# EAGLE board ElectroLab (EAGLE 9.5.1)
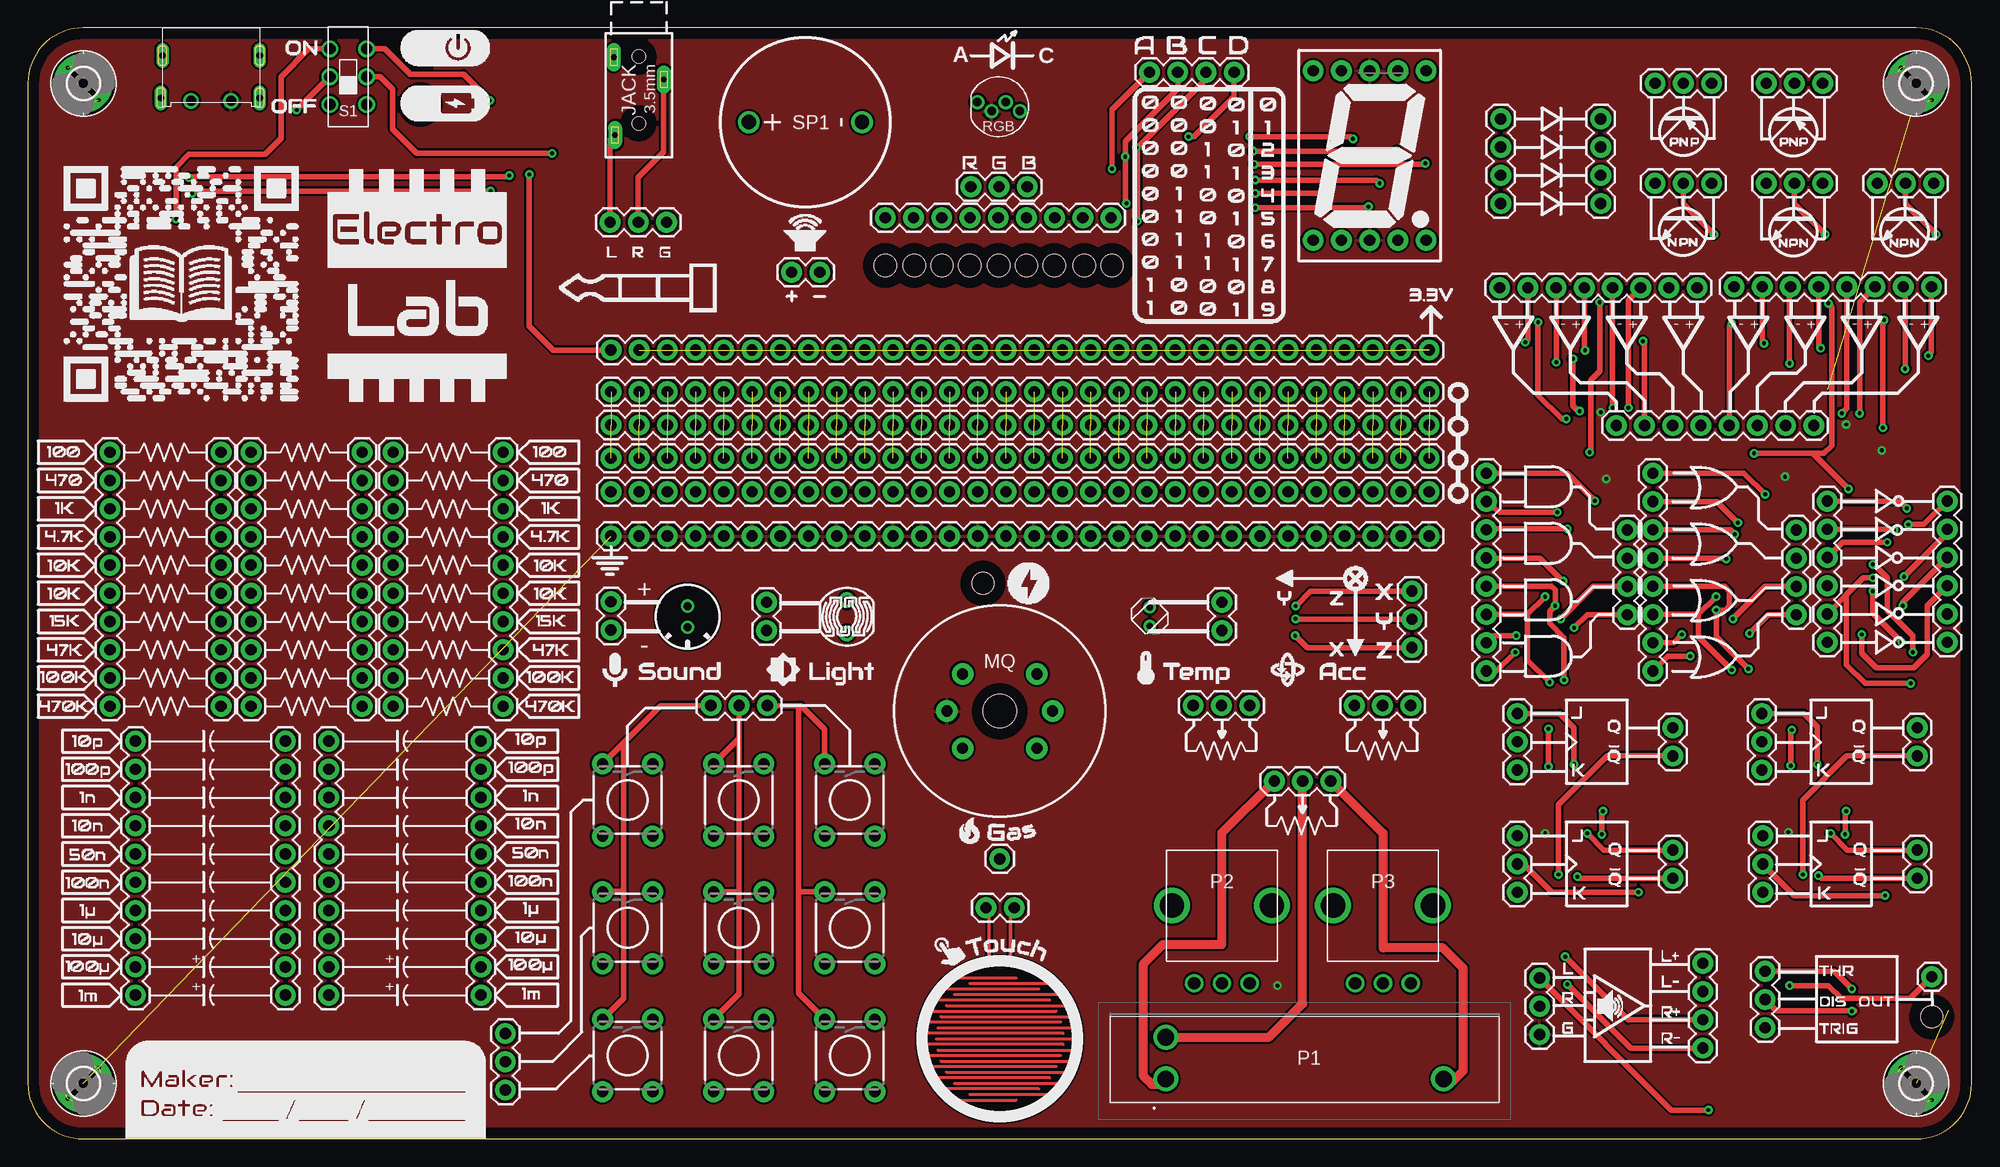
[diagram p4: board, top side]
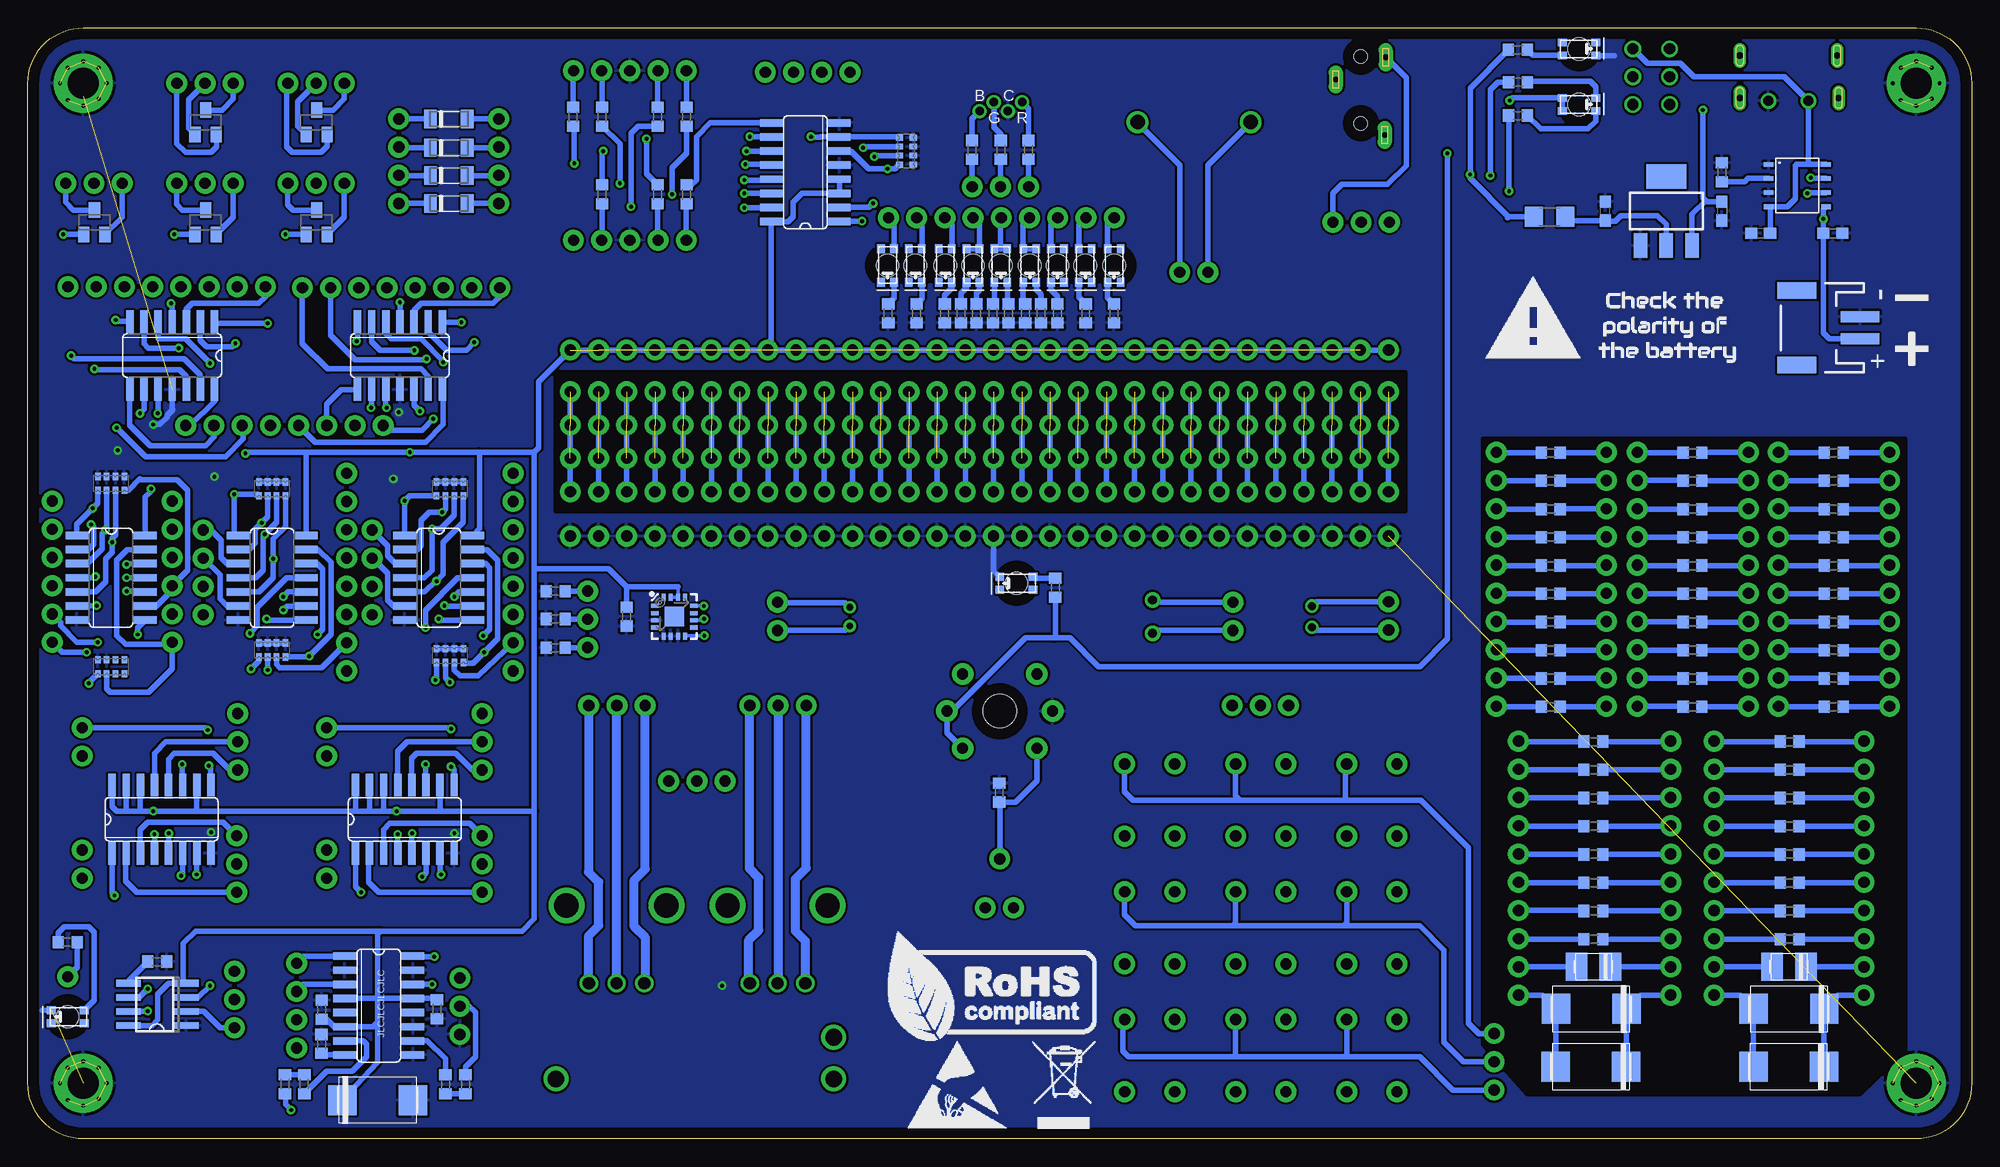
[diagram p5: board, bottom side, seen from below]

Size 175 x 100 mm. Coordinates in mm from the lower left corner, seen from the top.
Outline: 0,5 arc90 5,0 170,0 arc90 175,5 175,95 arc90 170,100 5,100 arc90 0,95 0,5
Copper layers (1*16): Top 0.035mm / dielectric 1.5mm / Bottom 0.035mm
Design rules "PCBWay *": minimum track width 4mil, minimum drill 0.3mm, track to track 0.205mm, track to pad 0.205mm, pad to pad 0.205mm, via to via 0.205mm, smd to smd 8mil, copper to edge 40mil, drill to drill 8mil, minimum pad ring 10mil, minimum via ring 8mil, stop-mask expansion 4mil, vias tented up to drill 25mil, thermal gap 10mil
bRestrict: area 6,4 to 44,63; area 51,56.5 to 127.5,69

## Footprints (pad centres in the part's own frame; a part is rotated, then mirrored left to right if it is on the bottom)
0603-ARC = smd 0.5 x 0.65: 1 -1.2,-0.625; 2 -0.4,-0.625; 3 0.4,-0.625; 4 1.2,-0.625; 5 1.2,0.625; 6 0.4,0.625; 7 -0.4,0.625; 8 -1.2,0.625
0603 = smd 1 x 1.1: 1 -0.86,0; 2 0.84,0
B/3528-21R = smd 1.95 x 2.5: + 1.525,0; - -1.525,0
D/7343-31R = smd 2.55 x 2.7: + 3.175,0; - -3.175,0
C0603 = smd 1.1 x 1: 1 -0.85,0; 2 0.85,0
LL-34 = smd 1.15 x 1.65: A 1.65,0; C -1.65,0
R1206 = smd 1.6 x 1.803: 1 -1.422,0; 2 1.422,0
2,8-PAD = drill 2.8 pad 5.334: B2,8 0,0
SO14 = smd 0.66 x 2.032: 1 -3.81,-3.073; 2 -2.54,-3.073; 3 -1.27,-3.073; 4 0,-3.073; 5 1.27,-3.073; 6 2.54,-3.073; 7 3.81,-3.073; 8 3.81,3.073; 9 2.54,3.073; 10 1.27,3.073; 11 0,3.073; 12 -1.27,3.073; 13 -2.54,3.073; 14 -3.81,3.073
SO16 = smd 0.66 x 2.032: 1 -4.445,-3.073; 2 -3.175,-3.073; 3 -1.905,-3.073; 4 -0.635,-3.073; 5 0.635,-3.073; 6 1.905,-3.073; 7 3.175,-3.073; 8 4.445,-3.073; 9 4.445,3.073; 10 3.175,3.073; 11 1.905,3.073; 12 0.635,3.073; 13 -0.635,3.073; 14 -1.905,3.073; 15 -3.175,3.073; 16 -4.445,3.073
SO08 = smd 0.6 x 2.2: 1 -1.905,-2.6; 2 -0.635,-2.6; 3 0.635,-2.6; 4 1.905,-2.6; 5 1.905,2.6; 6 0.635,2.6; 7 -0.635,2.6; 8 -1.905,2.6
SOT23-8 = smd 0.42 x 0.835: 1 -1.905,-2.58; 2 -0.635,-2.58; 3 0.635,-2.58; 4 1.905,-2.58; 5 1.905,2.58; 6 0.635,2.58; 7 -0.635,2.58; 8 -1.905,2.58
SOP-16 = smd 0.66 x 2.032: 1 -4.445,-3.073; 2 -3.175,-3.073; 3 -1.905,-3.073; 4 -0.635,-3.073; 5 0.635,-3.073; 6 1.905,-3.073; 7 3.175,-3.073; 8 4.445,-3.073; 9 4.445,3.073; 10 3.175,3.073; 11 1.905,3.073; 12 0.635,3.073; 13 -0.635,3.073; 14 -1.905,3.073; 15 -3.175,3.073; 16 -4.445,3.073
JST-2-SMD = smd 1 x 3.5: 1 1,3.95; 2 -1,3.95 | smd 1.5 x 3.5: NC1 3.35,-1.75; NC2 -3.35,-1.75
1X10 = drill 1.016 pad 1.88: 1 0,0; 2 2.54,0; 3 5.08,0; 4 7.62,0; 5 10.16,0; 6 12.7,0; 7 15.24,0; 8 17.78,0; 9 20.32,0; 10 22.86,0
1X04 = drill 1.016 pad 1.88: 1 0,0; 2 2.54,0; 3 5.08,0; 4 7.62,0
1X30 = drill 1.016 pad 1.88: 1 0,0; 2 2.54,0; 3 5.08,0; 4 7.62,0; 5 10.16,0; 6 12.7,0; 7 15.24,0; 8 17.78,0; 9 20.32,0; 10 22.86,0; 11 25.4,0; 12 27.94,0; 13 30.48,0; 14 33.02,0; 15 35.56,0; 16 38.1,0; 17 40.64,0; 18 43.18,0; 19 45.72,0; 20 48.26,0; 21 50.8,0; 22 53.34,0; 23 55.88,0; 24 58.42,0; 25 60.96,0; 26 63.5,0; 27 66.04,0; 28 68.58,0; 29 71.12,0; 30 73.66,0
1X03 = drill 1.016 pad 1.88: 1 0,0; 2 2.54,0; 3 5.08,0
1X02 = drill 1.016 pad 1.88: 1 0,0; 2 2.54,0
1X01 = drill 1.016 pad 1.88: 1 0,0
1X06 = drill 1.016 pad 1.88: 1 0,0; 2 2.54,0; 3 5.08,0; 4 7.62,0; 5 10.16,0; 6 12.7,0
1X09 = drill 1.016 pad 1.88: 1 0,0; 2 2.54,0; 3 5.08,0; 4 7.62,0; 5 10.16,0; 6 12.7,0; 7 15.24,0; 8 17.78,0; 9 20.32,0
HC-PJ-320A-3P-D = drill 0.5 pad 1.27 long: 1 2.25,2.15; 2 -2.25,4.15; 3 2.15,9.15 | hole 1.2: 0,2.1; 0,8.1
BICOLOR_LED = smd 0.8 x 0.7: 1 -1.5,0.585; 2 1.5,0.585; 3 1.5,-0.585; 4 -1.5,-0.585 | hole 2: 0,0
MICROPHONE = drill 0.7 pad 1.2: 1 0,0.95; 2 0,-0.95
NTC = drill 0.6: 1 -0.85,0; 2 0.85,0
RS201111J011 = drill 1.5 pad 2.25: 1 0,0; 2 0,3.75; 3 25,0
ALPS_RK09K_VERTICAL = drill 1.1: 1 -2.5,-7; 2 0,-7; 3 2.5,-7 | drill 2.2: P$1 -4.5,0; P$2 4.5,0
GL5516 = drill 0.8 pad 1.4: 1 -1.5,0; 3 1.5,0
R0603 = smd 1 x 1.1: 1 -0.85,0; 2 0.85,0
LED-RGB-THRU = drill 0.762 pad 1.016: B -1.905,0.4; C 0.635,0.4; G -0.635,-0.4; R 1.905,-0.4
DPDT_JS202011CQN = drill 1: 1 -2.5,-1.65; 2 0,-1.651; 3 2.5,-1.65; 4 -2.5,1.65; 5 0,1.651; 6 2.5,1.65
TACTILE_SWITCH_PTH_6.0MM = drill 1.016 pad 1.88: 1 -3.251,2.261; 2 3.251,2.261; 3 -3.251,-2.261; 4 3.251,-2.261
FS1508MB0810-H8.0 = drill 1.3: + 0,5.1; - 0,-5.1
SOT23 = smd 1.4 x 1: 1 -1.1,0.95; 2 -1.1,-0.95; 3 1.1,0
LFCSP-16-4X4 = smd 1.75 x 1.75: 0 0,0 | smd 0.65 x 0.37: 1 -1.75,0.975; 2 -1.75,0.325; 3 -1.75,-0.325; 4 -1.75,-0.975; 9 1.75,-0.975; 10 1.75,-0.325; 11 1.75,0.325; 12 1.75,0.975 | smd 0.37 x 0.65: 5 -0.975,-1.75; 6 -0.325,-1.75; 7 0.325,-1.75; 8 0.975,-1.75; 13 0.975,1.75; 14 0.325,1.75; 15 -0.325,1.75; 16 -0.975,1.75
GAS_SENSOR = drill 1.016 pad 1.93: A1 -3.35,3.35; A2 -3.35,-3.35; B1 3.35,3.35; B2 3.35,-3.35; HA -4.75,0; HB 4.75,0 | hole 3: 0,0
SOT223 = smd 1.219 x 2.235: 1 -2.311,-3.099; 2 0,-3.099; 3 2.311,-3.099 | smd 3.6 x 2.2: 4 0,3.099
7-SEGMENT = drill 1 pad 1.88: 1 -5.08,-7.62; 2 -2.54,-7.62; 3 0,-7.62; 4 2.54,-7.62; 5 5.08,-7.62; 6 5.08,7.62; 7 2.54,7.62; 8 0,7.62; 9 -2.54,7.62; 10 -5.08,7.62
1X08 = drill 1.016 pad 1.88: 1 0,0; 2 2.54,0; 3 5.08,0; 4 7.62,0; 5 10.16,0; 6 12.7,0; 7 15.24,0; 8 17.78,0
RESISTIVE_SENSOR_PAD = smd 0.305 x 0.61: 0 -0.95,7.65; 1 0.95,7.65
USB-C-POWER = drill 0.9: GND -1.8,4.08; VBUS 1.8,4.08 | drill 0.6 long: SHIELD1 -4.375,0; SHIELD2 -4.375,3.81; SHIELD3 4.515,3.81; SHIELD4 4.375,0

## Placement (x,y rotation side)
ARR1  4_RES_ARRAY_R06031KOHM  [0603-ARC]  137,58.5 0 bottom
ARR2  4_RES_ARRAY_R06031KOHM  [0603-ARC]  137,43.5 0 bottom
ARR3  4_RES_ARRAY_R06031KOHM  [0603-ARC]  153,58.5 0 bottom
ARR4  4_RES_ARRAY_R06031KOHM  [0603-ARC]  153,44 0 bottom
ARR5  4_RES_ARRAY_R06031KOHM  [0603-ARC]  167.5,59 0 bottom
ARR6  4_RES_ARRAY_R06031KOHM  [0603-ARC]  167.5,42.5 0 bottom
ARR7  4_RES_ARRAY_R06031KOHM  [0603-ARC]  95.9,88.9 270 bottom
C1  10pF  [0603]  34.07,35.76 180 bottom
C2  10pF  [0603]  16.41,35.76 180 bottom
C3  100pF  [0603]  34.07,33.22 180 bottom
C4  100pF  [0603]  16.41,33.22 180 bottom
C5  1nF  [0603]  34.07,30.68 180 bottom
C6  1nF  [0603]  16.41,30.68 180 bottom
C7  10nF  [0603]  34.07,28.14 180 bottom
C8  10nF  [0603]  16.41,28.14 180 bottom
C9  47nF  [0603]  34.07,25.6 180 bottom
C10  47nF  [0603]  16.41,25.6 180 bottom
C11  100nF  [0603]  34.07,23.06 180 bottom
C12  100nF  [0603]  16.41,23.06 180 bottom
C13  1uF  [0603]  34.07,20.52 180 bottom
C14  1uF  [0603]  16.41,20.52 180 bottom
C15  10uF  [0603]  34.07,17.98 180 bottom
C16  10uF  [0603]  16.41,17.98 180 bottom
C17  100uF  [B/3528-21R]  34.05,15.5 0 bottom
C18  100uF  [B/3528-21R]  16.45,15.5 0 bottom
C19  470uF  [D/7343-31R]  34.25,11.7 0 bottom
C20  470uF  [D/7343-31R]  16.45,11.7 0 bottom
C21  10n  [0603]  163.34,15.96 0 bottom
C22  470n  [0603]  135.6,4.9 270 bottom
C23  1u  [0603]  138.16,11.66 270 bottom
C24  1u  [0603]  148.54,11.64 90 bottom
C25  100n  [0603]  148.56,8.56 90 bottom
C26  470n  [0603]  151.84,4.94 90 bottom
C27  470u  [D/7343-31R]  143.5,3.5 180 bottom
C28  10uF  [C0603]  12.5,81.5 0 bottom
C29  0.1uF  [0603]  127.5,49.3 180 bottom
C30  0.1uF  [0603]  127.5,46.8 180 bottom
C31  0.1uF  [0603]  127.5,44.2 180 bottom
C32  0.1uF  [0603]  121.1,47 270 bottom
C35  470uF  [D/7343-31R]  34.28,6.5 0 bottom
C36  470uF  [D/7343-31R]  16.48,6.5 0 bottom
C37  10uF  [C0603]  19,81.5 180 bottom
C38  10uF  [C0603]  22.5,83.5 270 bottom
C39  10uF  [C0603]  33,83.5 90 bottom
D5  LL4148  [LL-34]  137.1,91.8 0 bottom
D6  LL4148  [LL-34]  137.1,89.2 0 bottom
D7  LL4148  [LL-34]  137.1,86.7 0 bottom
D8  LL4148  [LL-34]  137.1,84.2 0 bottom
F1  500mA  [R1206]  38,83 0 bottom
H1  MOUNT-PAD-ROUND2.8  [2,8-PAD]  170,95 0 top
H2  MOUNT-PAD-ROUND2.8  [2,8-PAD]  170,5 0 top
H3  MOUNT-PAD-ROUND2.8  [2,8-PAD]  5,95 0 top
H4  MOUNT-PAD-ROUND2.8  [2,8-PAD]  5,5 90 top
IC3  LM324DTD  [SO14]  141.5,70.5 180 bottom
IC4  LM324DTD  [SO14]  162,70.5 180 bottom
IC6  MC74HC112ADR2G  [SO16]  141.06,28.76 0 bottom
IC7  MC74HC112ADR2G  [SO16]  162.96,28.76 0 bottom
IC8  TLC555CDR  [SO08]  163.33,12.1 90 bottom
IC9  TP4056  [SOT23-8]  15.7,85.8 270 bottom
IC11  PAM8403  [SOP-16]  143.4,12 270 bottom
IC13  74HC08DD  [SO14]  138,50.5 270 bottom
IC14  74HC04DD  [SO14]  167.5,50.5 270 bottom
IC15  74HC32S14-13  [SO14]  153,50.5 270 bottom
J1  [JST-2-SMD]  14,73 270 bottom
J2  [1X10]  7.4,61.8 270 top
J3  [1X04]  150.8,15.8 270 top
J4  [1X10]  17.4,61.8 270 top
J5  [1X10]  20.1,61.8 270 top
J6  [1X10]  30.1,61.8 270 top
J7  [1X10]  32.9,61.8 270 top
J8  [1X10]  42.8,61.8 270 top
J9  [1X10]  27.1,35.8 270 top
J10  [1X10]  40.8,35.8 270 top
J11  [1X10]  9.7,35.8 270 top
J12  [1X10]  23.2,35.8 270 top
J14  [1X30]  52.5,54.25 0 top
J15  [1X30]  52.5,58.25 0 top
J16  [1X30]  52.5,67.25 0 top
J17  [1X30]  52.5,64.25 0 top
J18  [1X30]  52.5,61.25 0 top
J19  [1X30]  52.5,71 0 top
J20  [1X03]  43,4.4 90 top
J21  [1X03]  61.5,39 0 top
J22  [1X03]  117.3,32.2 180 top
J23  [1X03]  110,39 180 top
J24  [1X03]  124.5,39 180 top
J25  [1X03]  124.6,49.3 270 top
J26  [1X03]  134.1,22.2 90 top
J27  [1X03]  134.1,33.2 90 top
J28  [1X03]  156.2,22.2 90 top
J29  [1X03]  156.1,33.2 90 top
J30  [1X03]  156.4,10 90 top
J31  [1X03]  146.5,86 0 top
J32  [1X03]  156.5,86 0 top
J33  [1X03]  166.5,86 0 top
J34  [1X03]  146.5,95 0 top
J35  [1X03]  156.5,95 0 top
J36  [1X03]  136.1,9.4 90 top
J37  [1X03]  84.9,85.7 0 top
J38  [1X02]  52.5,45.8 90 top
J39  [1X02]  66.5,48.3 270 top
J40  [1X02]  107.5,48.3 270 top
J41  [1X02]  88.8,20.8 180 top
J42  [1X01]  87.5,25.2 0 top
J43  [1X04]  159.2,54.8 270 top
J44  [1X04]  141.6,91.8 270 top
J45  [1X06]  162,57.4 270 top
J46  [1X06]  172.8,57.4 270 top
J47  [1X02]  148.1,26 270 top
J48  [1X02]  148.1,37 270 top
J49  [1X02]  170.1,26 270 top
J50  [1X02]  170.1,37 270 top
J51  [1X01]  171.4,14.6 0 top
J52  [1X04]  144,54.8 270 top
J53  [1X04]  132.6,91.8 270 top
J54  [1X02]  71.3,78 180 top
J55  [1X04]  108.6,96 180 top
J56  [1X09]  77.2,82.9 0 top
JACK  AUDIO_JACK_MONO_3.5_3P  [HC-PJ-320A-3P-D]  55,99.5 180 top
LED1  E6CC1205RYGC2UDA  [BICOLOR_LED]  35.35,93.1 180 bottom
LED2  E6CC1205RYGC2UDA  [BICOLOR_LED]  35.35,98.1 180 bottom
LED3  E6CC1205RYGC2UDA  [BICOLOR_LED]  171.4,11 0 bottom
LED4  E6CC1205RYGC2UDA  [BICOLOR_LED]  77.2,78.6 90 bottom
LED5  E6CC1205RYGC2UDA  [BICOLOR_LED]  79.8,78.6 90 bottom
LED6  E6CC1205RYGC2UDA  [BICOLOR_LED]  82.3,78.6 90 bottom
LED7  E6CC1205RYGC2UDA  [BICOLOR_LED]  84.8,78.6 90 bottom
LED8  E6CC1205RYGC2UDA  [BICOLOR_LED]  87.4,78.6 90 bottom
LED9  E6CC1205RYGC2UDA  [BICOLOR_LED]  89.9,78.6 90 bottom
LED10  E6CC1205RYGC2UDA  [BICOLOR_LED]  92.4,78.6 90 bottom
LED11  E6CC1205RYGC2UDA  [BICOLOR_LED]  95.1,78.6 90 bottom
LED12  E6CC1205RYGC2UDA  [BICOLOR_LED]  97.6,78.6 90 bottom
LED13  E6CC1205RYGC2UDA  [BICOLOR_LED]  86,50 0 bottom
MIC  MICROPHONE  [MICROPHONE]  59.4,47 0 top
NTC  [NTC]  101,47 90 top
P1  SLIDE_POT_20MM  [RS201111J011]  102.45,5.4 0 top
P2  [ALPS_RK09K_VERTICAL]  107.5,21 0 top
P3  [ALPS_RK09K_VERTICAL]  122,21 0 top
PH1  PHOTORESISTOR  [GL5516]  73.74,47 270 top
PH12  [1X03]  57.5,82.5 180 top
R1  100  [0603]  12.43,61.76 180 bottom
R2  100  [0603]  25.15,61.76 180 bottom
R3  100  [0603]  37.92,61.76 180 bottom
R4  470  [0603]  12.43,59.23 180 bottom
R5  470  [0603]  25.15,59.22 180 bottom
R6  470  [0603]  37.92,59.22 180 bottom
R7  1K  [0603]  12.43,56.68 180 bottom
R8  1K  [0603]  25.15,56.68 180 bottom
R9  1K  [0603]  37.92,56.68 180 bottom
R10  4.7K  [0603]  12.43,54.14 180 bottom
R11  4.7K  [0603]  25.15,54.14 180 bottom
R12  4.7K  [0603]  37.92,54.14 180 bottom
R13  10K  [0603]  12.43,51.6 180 bottom
R14  10K  [0603]  25.15,51.6 180 bottom
R15  10K  [0603]  37.92,51.6 180 bottom
R16  10K  [0603]  12.43,49.06 180 bottom
R17  10K  [0603]  25.15,49.06 180 bottom
R18  10K  [0603]  37.92,49.06 180 bottom
R19  15K  [0603]  12.43,46.52 180 bottom
R20  15K  [0603]  25.15,46.52 180 bottom
R21  15K  [0603]  37.92,46.52 180 bottom
R22  47K  [0603]  12.43,43.98 180 bottom
R23  47K  [0603]  25.15,43.98 180 bottom
R24  47K  [0603]  37.92,43.98 180 bottom
R25  100K  [0603]  12.43,41.44 180 bottom
R26  100K  [0603]  25.15,41.44 180 bottom
R27  100K  [0603]  37.92,41.44 180 bottom
R28  470K  [0603]  12.43,38.9 180 bottom
R29  470K  [0603]  25.15,38.9 180 bottom
R30  470K  [0603]  37.92,38.9 180 bottom
R31  470  [0603]  40.85,98.02 0 bottom
R32  1.2k  [R0603]  22.5,87 270 bottom
R33  1K  [0603]  40.85,95.1 180 bottom
R34  1k  [0603]  40.85,92.1 180 bottom
R35  470  [0603]  83.8,74.3 90 bottom
R36  470  [0603]  86.7,74.3 90 bottom
R37  470  [0603]  89.6,74.3 90 bottom
R38  330  [0603]  82.5,49.6 270 bottom
R39  330  [0603]  171.4,17.7 0 bottom
R40  10k  [0603]  137.4,4.9 270 bottom
R41  330  [0603]  123.3,92 90 bottom
R42  330  [0603]  125.9,92 90 bottom
R43  330  [0603]  123.3,85 270 bottom
R44  330  [0603]  118.3,85 270 bottom
R45  330  [0603]  115.7,85 270 bottom
R46  330  [0603]  118.3,92 90 bottom
R47  330  [0603]  115.7,92 90 bottom
R48  330  [0603]  77.22,74.3 90 bottom
R49  330  [0603]  79.76,74.3 90 bottom
R50  330  [0603]  82.3,74.3 90 bottom
R51  330  [0603]  85.2,74.3 90 bottom
R52  330  [0603]  88.1,74.3 90 bottom
R53  330  [0603]  91,74.3 90 bottom
R54  330  [0603]  92.46,74.3 90 bottom
R55  330  [0603]  95,74.3 90 bottom
R56  330  [0603]  97.54,74.3 90 bottom
R57  150  [0603]  84.9,89 270 bottom
R58  150  [0603]  87.4,89 270 bottom
R59  220  [0603]  90,89 270 bottom
R60  10k  [0603]  150.1,4.94 90 bottom
R67  10k  [0603]  87.54,31.16 270 bottom
RGB  CLEAR  [LED-RGB-THRU]  87.4,92.9 180 top
S1  DPDT_JS202011CQN  [DPDT_JS202011CQN]  28.85,95.6 90 top
S2  MOMENTARY-SWITCH-SPST-PTH-6.0MM  [TACTILE_SWITCH_PTH_6.0MM]  54,30.5 270 top
S3  MOMENTARY-SWITCH-SPST-PTH-6.0MM  [TACTILE_SWITCH_PTH_6.0MM]  64,30.5 270 top
S4  MOMENTARY-SWITCH-SPST-PTH-6.0MM  [TACTILE_SWITCH_PTH_6.0MM]  74,30.5 270 top
S5  MOMENTARY-SWITCH-SPST-PTH-6.0MM  [TACTILE_SWITCH_PTH_6.0MM]  54,19 270 top
S6  MOMENTARY-SWITCH-SPST-PTH-6.0MM  [TACTILE_SWITCH_PTH_6.0MM]  64,19 270 top
S7  MOMENTARY-SWITCH-SPST-PTH-6.0MM  [TACTILE_SWITCH_PTH_6.0MM]  74,19 270 top
S8  MOMENTARY-SWITCH-SPST-PTH-6.0MM  [TACTILE_SWITCH_PTH_6.0MM]  54,7.5 270 top
S9  MOMENTARY-SWITCH-SPST-PTH-6.0MM  [TACTILE_SWITCH_PTH_6.0MM]  64,7.5 270 top
S10  MOMENTARY-SWITCH-SPST-PTH-6.0MM  [TACTILE_SWITCH_PTH_6.0MM]  74,7.5 270 top
SP1  SPEAKERFS1508MB0810-H8.0  [FS1508MB0810-H8.0]  70,91.5 90 top
T1  MMBT2222A  [SOT23]  149,82.5 90 bottom
T2  T_NPNMMBT2222A-1P_CHANGJ_SOT23-BEC  [SOT23]  159,82.5 90 bottom
T3  T_NPNMMBT2222A-1P_CHANGJ_SOT23-BEC  [SOT23]  169,82.5 90 bottom
T4  T_PNPMMBT5401_CHANGJ_SOT23-BEC  [SOT23]  149,91.5 90 bottom
T5  T_PNPMMBT5401_CHANGJ_SOT23-BEC  [SOT23]  159,91.5 90 bottom
U1  ADXL335  [LFCSP-16-4X4]  116.8,47 0 bottom
U2  GAS_SENSOR  [GAS_SENSOR]  87.5,38.5 180 top
U3  AMS1117-3.3VSMD  [SOT223]  27.5,83.5 0 bottom
U$1  FJ5101AG  [7-SEGMENT]  120.8,88.5 0 top
U$2  CONN_08  [1X08]  131.3,59.9 270 top
U$3  CONN_08  [1X08]  146.3,59.9 270 top
U$4  CONN_08  [1X08]  132.5,76.6 0 top
U$5  CONN_08  [1X08]  153.6,76.7 0 top
U$6  CONN_08  [1X08]  143,64.2 0 top
U$7  CD4511BNSR  [SO16]  105,87 90 bottom
U$16  RESISTIVE_SENSOR_PAD  [RESISTIVE_SENSOR_PAD]  87.5,9 0 top
X8  USB-C-POWER  [USB-C-POWER]  16.5,97.5 180 top

## Tracks (layer width: path | path; a pad name or v marks a point on that pad's centre or on a via)
5V  (via drill 0.35)
  Top 0.508: v47.2,88.7 35,88.7 32.85,90.85 32.85,94.45 31.7,95.6 S1.2
  Bottom 0.508: 82.6,45.1 81.2,45.1 78.6,42.5 49.7,42.5 47.2,45 v47.2,88.7 | 82.6,45.1 85.2,45.1 91.8,38.5 U2.HA 92.25,36.55 U2.A1 | R38.2 82.5,45.2 82.6,45.1
A1A  (via drill 0.35)
  Top 0.508: U$2.1 138.6,59.9 v141.07,57.43
  Bottom 0.508: IC13.1 v141.07,57.43 140.62,57.88 ARR1.1
A1B  (via drill 0.35)
  Top 0.508: U$2.2 132.46,56.4 v137.7,56.4
  Bottom 0.508: IC13.2 139.96,53.04 139.6,53.4 139.6,53.79 139.6,55.68 138.88,56.4 v137.7,56.4 137.4,56.7 ARR1.2
A1Y
  Bottom 0.508: IC13.3 141.87,51.77 142.6,52.5 142.6,53.4 J52.1
A2A  (via drill 0.35)
  Top 0.508: U$2.3 131.6,54.92 138.58,54.92 v138.6,54.9
  Bottom 0.508: IC13.4 139.3,50.5 138.6,51.2 v138.6,54.9 137.82,54.9 136.6,56.12 ARR1.3
A2B  (via drill 0.35)
  Top 0.508: v138.2,50.2 136.12,52.28 U$2.4
  Bottom 0.508: ARR1.4 135.8,55.5 137.6,53.7 137.6,50.8 v138.2,50.2 138.3,50.2 139.27,49.23 IC13.5
A2Y
  Bottom 0.508: IC13.6 142.06,47.96 142.6,48.5 142.6,50.9 143.96,52.26 J52.2
A3A  (via drill 0.35)
  Top 0.508: U$2.5 137.18,49.74 137.5,49.42 v137.5,48 137,47.5 137,46.42 138.3,45.12 v138.3,41.3
  Bottom 0.508: v138.3,41.3 138.2,41.4 ARR2.1 | IC13.9 137.46,47.96 v137.5,48
A3B  (via drill 0.35)
  Top 0.508: v136.6,48.8 135,47.2 | 135,47.2 U$2.6 | 135,47.2 135,43.1 v137,41.1
  Bottom 0.508: IC13.10 136.17,49.23 v136.6,48.8 | v137,41.1 137.4,41.5 ARR2.2
A3Y  (via drill 0.35)
  Top 0.508: J52.3 140.92,49.72 v138,46.8
  Bottom 0.508: v138,46.8 137.89,46.69 IC13.8
A4A  (via drill 0.35)
  Top 0.508: U$2.7 131.94,45.3 v134,45.3
  Bottom 0.508: ARR2.3 136.6,42.2 136.1,41.7 134.46,41.7 U$2.7 | IC13.12 133.83,51.77 133.8,51.8 133.41,51.41 133.41,45.89 v134,45.3
A4B  (via drill 0.35)
  Top 0.508: U$2.8 132.22,42.12 v133.9,43.8
  Bottom 0.508: IC13.13 133.64,53.04 132.7,52.1 132.7,45 v133.9,43.8 134.9,42.8 135.72,42.8 ARR2.4
A4Y  (via drill 0.35)
  Top 0.508: J52.4 140.38,47.18 v139.2,46
  Bottom 0.508: v139.2,46 139.2,47.6 136.3,50.5 IC13.11
B
  Bottom 0.508: J37.3 90,85.72 R59.2
G
  Bottom 0.508: J37.2 87.44,88.12 R58.2
GND  (via drill 0.35)  (7 unrouted)
  Top 0.508: H1.B2,8 170,93.84
  Bottom 0.508: ARR1.8 ARR1.5 | ARR2.5 ARR2.8 | ARR3.8 ARR3.5 | ARR4.8 ARR4.5 | LED2.1 33.84,97.5 32.15,97.5 | LED3.1 172.91,11.6 173.7,11.6 | IC4.11 162,65.69 161.95,65.63 162.46,65.12 162.46,64.95 163.12,64.3 v163.7,64.3 | LED13.1 88.06,51.15 J14.15
  other vias: 142.1,59.4 141.6,65.4 158.2,59.6 5,97 2.9,95 5,93 7.1,95 6.4,93.5 6.4,96.4 3.6,96.4 3.6,93.6 112.5,13.8 166.9,61.97 158.5,27.6 136.6,27.5
  pour Top: 0,5 arc90 5,0 170,0 arc90 175,5 175,95 arc90 170,100 5,100 arc90 0,95
  pour Bottom: 0,5 arc90 5,0 170,0 arc90 175,5 175,95 arc90 170,100 5,100 arc90 0,95
GND1  (via drill 0.35)  (7 unrouted)
  other vias: 5,7 2.9,5 5,3 7.1,5 6.4,3.5 6.4,6.4 3.6,6.4 3.6,3.6
GND2  (via drill 0.35)  (7 unrouted)
  other vias: 170,7 167.9,5 170,3 172.1,5 171.4,3.5 171.4,6.4 168.6,6.4 168.6,3.6
GND3  (via drill 0.35)  (7 unrouted)
  other vias: 170,97 167.9,95 170,93 172.1,95 171.4,93.5 171.4,96.4 168.6,96.4 168.6,93.6
I1A  (via drill 0.35)
  Top 0.508: J45.1 168.5,57.4 v169.15,56.75
  Bottom 0.508: IC14.1 170.57,55.33 v169.15,56.75 168.7,57.2 ARR5.1
I1Y  (via drill 0.35)
  Top 0.508: v169.3,55.3 170.7,55.3 J46.1
  Bottom 0.508: v169.3,55.3 169.07,55.07 169.07,53.54 169.57,53.04 IC14.2
I2A  (via drill 0.35)
  Top 0.508: J45.2 167.94,54.86 v168,54.8
  Bottom 0.508: ARR5.2 167.9,54.77 167.93,54.8 v168,54.8 168.3,54.5 168.3,53.1 169.7,51.7 170.5,51.7 IC14.3
I2Y  (via drill 0.35)
  Top 0.508: J46.2 172.8,54.5 v168.9,50.6
  Bottom 0.508: v168.9,50.6 169,50.5 IC14.4
I3A  (via drill 0.35)
  Top 0.508: J45.3 163.38,53.7 v167.4,53.7
  Bottom 0.508: ARR5.3 167.1,54.38 167.4,54.08 v167.4,53.7 167.4,52.8 167.97,52.23 167.97,50.13 168.87,49.23 IC14.5
I3Y  (via drill 0.35)
  Top 0.508: J46.3 168.8,48.32 v168.8,48
  Bottom 0.508: v168.8,48 170.53,48 IC14.6
I4A
  Bottom 0.508: IC14.9 163.44,47.96 162,49.4 J45.4 160.6,51.18 160.6,58.38 161.56,59.34 164.84,59.34 164.9,59.4 165.93,58.38 ARR5.4
I4Y  (via drill 0.35)
  Top 0.508: v165.1,45.4 165.1,43.7 166.4,42.4 169.8,42.4 171,43.6 171,47.98 J46.4
  Bottom 0.508: IC14.8 165.1,46.02 v165.1,45.4
I5A  (via drill 0.35)
  Top 0.508: J45.5 163.73,48.97 | 163.73,48.97 165.26,50.5 v166.1,50.5 | v169.5,41 165.4,41 163.73,42.67 163.73,48.97
  Bottom 0.508: IC14.11 v166.1,50.5 | ARR6.1 169.5,41.08 v169.5,41
I5Y  (via drill 0.35)
  Top 0.508: v166.1,49.3 166.1,47.3 v168.7,44.7
  Bottom 0.508: v166.1,49.3 164.5,49.3 IC14.10 | J46.5 172.05,46.49 172.05,46.17 170.58,44.7 v168.7,44.7
I6A
  Bottom 0.508: J45.6 162,44.5 | 162,44.5 162,42.3 164.1,40.2 167.6,40.2 167.9,40.5 ARR6.2 | IC14.13 166.06,53.04 167,52.1 167,45.3 166.2,44.5 162,44.5
I6Y  (via drill 0.35)
  Top 0.508: v166.1,51.7 166.2,51.7 167.4,50.5 167.4,47.6 169.7,45.3 v169.7,43.8
  Bottom 0.508: IC14.12 166.03,51.77 v166.1,51.7 | v169.7,43.8 171.9,43.8 J46.6
IA  (via drill 0.35)
  Top 0.508: v104.5,90.2 105,90.2 108.6,93.8 J55.1
  Bottom 0.508: ARR7.1 96.6,90.17 U$7.7 103.64,90.17 103.65,90.16 104.46,90.16 v104.5,90.2
IB  (via drill 0.35)
  Top 0.508: v99.9,82.6 99.9,89.1 v99.8,89.2 99.9,89.2 106.06,95.36 J55.2
  Bottom 0.508: ARR7.2 99.7,89.3 v99.8,89.2 | v99.9,82.6 101.88,82.6 U$7.1
IC  (via drill 0.35)
  Top 0.508: v98.9,84.2 98.8,84.3 v98.8,88.4 98.8,89.8 103.52,94.52 J55.3
  Bottom 0.508: ARR7.3 98.7,88.5 v98.8,88.4 | v98.9,84.2 99.28,83.83 U$7.2
ID  (via drill 0.35)
  Top 0.508: J55.4 97.6,92.62 v97.6,87.3
  Bottom 0.508: U$7.6 100.91,88.91 99.3,87.3 v97.6,87.3 96.92,87.3 ARR7.4
IN_L  (via drill 0.35)
  Top 0.508: J36.3 147.98,2.6 v151.3,2.6
  Bottom 0.508: v151.3,2.6 151.8,3.1 151.8,4.04 C26.1
IN_R
  Bottom 0.508: C22.1 135.6,6.5 134.7,7.4 134.7,11.4 135.3,12 136.04,12 J36.2
INL
  Bottom 0.508: IC11.7 144.82,8.82 144.5,8.5 144.5,7.4 145.8,6.1 148.08,6.1 R60.1
INR
  Bottom 0.508: IC11.10 139.03,8.82 137.4,7.2 R40.1
L1
  Bottom 0.508: LED4.2 77.78,82.31 J56.1
L2
  Bottom 0.508: LED5.2 80.39,82.25 J56.2
L3
  Bottom 0.508: LED6.2 82.89,82.3 J56.3
L4
  Bottom 0.508: J56.4 85.39,82.33 LED7.2 LED7.3
L5
  Bottom 0.508: J56.5 87.42,82.84 87.42,80.1 LED8.3 LED8.2
L6
  Bottom 0.508: LED9.2 LED9.3 89.31,82.31 J56.6
L7
  Bottom 0.508: LED10.3 91.81,82.28 J56.7
L8
  Bottom 0.508: LED11.3 94.52,82.44 J56.8
L9
  Bottom 0.508: LED12.3 97.02,82.39 J56.9
N$1
  Bottom 0.508: R1.1 7.44,61.76 J2.1
N$2
  Bottom 0.508: R4.1 7.43,59.23 J2.2
N$3
  Bottom 0.508: R7.1 7.44,56.68 J2.3
N$4
  Bottom 0.508: R10.1 7.44,54.14 J2.4
N$5
  Bottom 0.508: R13.1 7.44,51.6 J2.5
N$6
  Bottom 0.508: R16.1 7.44,49.06 J2.6
N$7
  Bottom 0.508: R19.1 7.44,46.52 J2.7
N$8
  Bottom 0.508: R22.1 7.44,43.98 J2.8
N$9
  Bottom 0.508: R25.1 7.44,41.44 J2.9
N$10
  Bottom 0.508: R28.1 7.44,38.9 J2.10
N$11
  Bottom 0.508: R28.2 17.36,38.9 J4.10
N$12
  Bottom 0.508: R25.2 17.36,41.44 J4.9
N$13
  Bottom 0.508: R22.2 17.36,43.98 J4.8
N$14
  Bottom 0.508: R19.2 13.31,46.56 J4.7
N$15
  Bottom 0.508: R13.2 17.36,51.6 J4.5
N$16
  Bottom 0.508: R16.2 17.36,49.06 J4.6
N$17
  Bottom 0.508: J4.4 17.36,54.14 R10.2
N$18
  Bottom 0.508: J4.3 17.36,56.68 R7.2
N$19
  Bottom 0.508: R4.2 17.36,59.23 J4.2
N$20
  Bottom 0.508: R1.2 17.36,61.76 J4.1
N$21
  Bottom 0.508: J5.1 24.25,61.8 R2.1
N$22
  Bottom 0.508: R5.1 20.14,59.22 J5.2
N$23
  Bottom 0.508: R8.1 20.14,56.68 J5.3
N$24
  Bottom 0.508: R11.1 24.25,54.18 J5.4
N$25
  Bottom 0.508: R14.1 20.14,51.6 J5.5
N$26
  Bottom 0.508: R17.1 20.14,49.06 J5.6
N$27
  Bottom 0.508: R20.1 20.14,46.52 J5.7
N$28
  Bottom 0.508: R23.1 20.14,43.98 J5.8
N$29
  Bottom 0.508: R26.1 20.14,41.44 J5.9
N$30
  Bottom 0.508: R29.1 20.14,38.9 J5.10
N$31
  Bottom 0.508: R29.2 26.03,38.94 J6.10
N$32
  Bottom 0.508: R26.2 26.03,41.48 J6.9
N$33
  Bottom 0.508: R23.2 30.06,43.98 J6.8
N$34
  Bottom 0.508: R20.2 26.03,46.56 J6.7
N$35
  Bottom 0.508: R17.2 30.06,49.06 J6.6
N$36
  Bottom 0.508: R14.2 30.06,51.6 J6.5
N$37
  Bottom 0.508: J6.4 30.06,54.14 R11.2
N$38
  Bottom 0.508: R8.2 30.06,56.68 J6.3
N$39
  Bottom 0.508: R5.2 26.03,59.26 J6.2
N$40
  Bottom 0.508: R2.2 30.06,61.76 J6.1
N$41
  Bottom 0.508: R3.1 32.94,61.76 J7.1
N$42
  Bottom 0.508: R6.1 32.94,59.22 J7.2
N$43
  Bottom 0.508: J7.3 37.02,56.72 R9.1
N$44
  Bottom 0.508: R12.1 32.94,54.14 J7.4
N$45
  Bottom 0.508: R15.1 32.94,51.6 J7.5
N$46
  Bottom 0.508: R18.1 32.94,49.06 J7.6
N$47
  Bottom 0.508: R21.1 32.94,46.52 J7.7
N$48
  Bottom 0.508: R24.1 32.94,43.98 J7.8
N$49
  Bottom 0.508: R27.1 32.94,41.44 J7.9
N$50
  Bottom 0.508: R30.1 32.94,38.9 J7.10
N$51
  Bottom 0.508: R30.2 42.76,38.9 J8.10
N$52
  Bottom 0.508: R27.2 42.76,41.44 J8.9
N$53
  Bottom 0.508: R24.2 42.76,43.98 J8.8
N$54
  Bottom 0.508: R21.2 42.76,46.52 J8.7
N$55
  Bottom 0.508: R18.2 42.76,49.06 J8.6
N$56
  Bottom 0.508: R15.2 42.76,51.6 J8.5
N$57
  Bottom 0.508: J8.4 42.76,54.14 R12.2
N$58
  Bottom 0.508: R9.2 42.76,56.68 J8.3
N$59
  Bottom 0.508: R6.2 42.76,59.22 J8.2
N$60
  Bottom 0.508: R3.2 42.76,61.76 J8.1
N$61
  Bottom 0.508: C1.1 27.14,35.76 J9.1
N$62
  Bottom 0.508: C3.1 27.14,33.22 J9.2
N$63
  Bottom 0.508: C5.1 27.14,30.68 J9.3
N$64
  Bottom 0.508: C7.1 27.14,28.14 J9.4
N$65
  Bottom 0.508: C9.1 27.14,25.6 J9.5
N$66
  Bottom 0.508: C11.1 27.14,23.06 J9.6
N$67
  Bottom 0.508: C13.1 27.14,20.52 J9.7
N$68
  Bottom 0.508: C15.1 27.14,17.98 J9.8
N$69
  Bottom 0.508: C17.+ 27.12,15.5 J9.9
N$70
  Bottom 0.508: C35.+ 31.1,11.68 C19.+ 29.84,12.94 J9.10
N$71
  Bottom 0.508: C1.2 40.76,35.76 J10.1
N$72
  Bottom 0.508: C3.2 40.76,33.22 J10.2
N$73
  Bottom 0.508: C5.2 40.76,30.68 J10.3
N$74
  Bottom 0.508: C7.2 40.76,28.14 J10.4
N$75
  Bottom 0.508: C9.2 40.76,25.6 J10.5
N$76
  Bottom 0.508: C11.2 40.76,23.06 J10.6
N$77
  Bottom 0.508: C13.2 34.95,20.56 J10.7
N$78
  Bottom 0.508: C15.2 40.76,17.98 J10.8
N$79
  Bottom 0.508: C17.- 40.78,15.5 J10.9
N$80
  Bottom 0.508: C35.- 37.45,11.68 C19.- 38.67,12.94 J10.10
N$81
  Bottom 0.508: C2.1 9.74,35.76 J11.1
N$82
  Bottom 0.508: C4.1 9.74,33.22 J11.2
N$83
  Bottom 0.508: C6.1 9.74,30.68 J11.3
N$84
  Bottom 0.508: C8.1 9.74,28.14 J11.4
N$85
  Bottom 0.508: C10.1 9.74,25.6 J11.5
N$86
  Bottom 0.508: C12.1 9.74,23.06 J11.6
N$87
  Bottom 0.508: C14.1 9.74,20.52 J11.7
N$88
  Bottom 0.508: C16.1 9.74,17.98 J11.8
N$89
  Bottom 0.508: C18.+ 9.72,15.5 J11.9
N$90
  Bottom 0.508: J11.10 12.04,12.94 C20.+ 13.3,11.68 C36.+
N$91
  Bottom 0.508: C20.- 19.65,11.72 | J12.10 20.87,12.94 19.91,11.99 19.65,11.72 | C36.- 19.65,11.72
N$92
  Bottom 0.508: C18.- 23.18,15.5 J12.9
N$93
  Bottom 0.508: C16.2 23.16,17.98 J12.8
N$94
  Bottom 0.508: C14.2 23.16,20.52 J12.7
N$95
  Bottom 0.508: C12.2 23.16,23.06 J12.6
N$96
  Bottom 0.508: C10.2 17.29,25.64 J12.5
N$97
  Bottom 0.508: C8.2 23.16,28.14 J12.4
N$98
  Bottom 0.508: C6.2 23.16,30.68 J12.3
N$99
  Bottom 0.508: C4.2 23.16,33.22 J12.2
N$100
  Bottom 0.508: C2.2 23.16,35.76 J12.1
N$101
  Bottom 0.508: D8.A 132.62,84.2 J53.4
N$102
  Top 0.508: JACK.2 57.25,88.85 54.96,86.56 PH12.2
N$103
  Bottom 0.508: LED2.2 39.51,97.52 R31.2
N$104  (via drill 0.35)
  Top 0.508: v41.65,85.3 15,85.3 v14.8,85.1
  Bottom 0.508: R34.2 41.69,85.34 v41.65,85.3 | v14.8,85.1 14.73,85.17 IC9.6
N$105
  Bottom 0.508: LED1.4 33.85,94.7 34.35,95.2 39.89,95.2 R33.1
N$106
  Bottom 0.508: LED1.1 33.85,91.6 34.55,90.9 38.79,90.9 R34.1
N$107
  Bottom 0.508: IC9.2 20.16,86.44 20.45,86.15 R32.2
N$108  (via drill 0.35)
  Top 0.508: v14.5,86.5 14.6,86.6 43.25,86.6 v43.35,86.7
  Bottom 0.508: IC9.7 14.44,86.44 v14.5,86.5 | v43.35,86.7 43.35,94.4 42.65,95.1 R33.2
N$109  (via drill 0.35)
  Top 0.508: v24.2,92.6 S1.5
  Bottom 0.508: 23.95,84.45 24.2,84.7 v24.2,92.6 | 23.95,84.45 23.85,84.35 C38.1 | U3.3 25.19,83.21 23.95,84.45
N$110
  Bottom 0.508: D8.C 141.58,84.2 J44.4
N$111
  Bottom 0.508: D5.A J53.1
N$112  (via drill 0.35)
  Top 0.508: J47.1 141.9,26 v140.4,27.5
  Bottom 0.508: v140.4,27.5 140.43,27.48 IC6.5
N$113  (via drill 0.35)
  Top 0.508: v136.9,33.5 v136.9,36.9
  Bottom 0.508: IC6.9 136.62,33.22 v136.9,33.5 | v136.9,36.9 137,37 J48.1
N$114  (via drill 0.35)
  Top 0.508: v162.3,27.5 163.8,26 J49.1
  Bottom 0.508: IC7.5 162.32,27.48 v162.3,27.5
N$115  (via drill 0.35)
  Top 0.508: v158.7,33.6 158.7,36.7 v158.8,36.8
  Bottom 0.508: IC7.9 158.51,33.41 v158.7,33.6 | v158.8,36.8 159,37 J50.1
N$116
  Bottom 0.508: PH12.1 57.5,85.1 56.7,85.9 52.6,85.9 50.9,87.6 50.9,95.5 JACK.1
N$117
  Bottom 0.508: RGB.G 88.03,91.03 87.4,90.4 R58.1
N$118
  Bottom 0.508: LED4.1 77.78,75.7 R48.2
N$119
  Bottom 0.508: U2.B1 84.15,32.25 86.1,30.3 87.53,30.3 R67.2 87.5,30.28 J42.1
N$120
  Bottom 0.508: LED13.2 84.38,50.46 R38.1
N$122
  Bottom 0.508: R39.1 172.26,18.54 171.7,19.1 169.5,19.1 169,18.6 169,12.48 LED3.2
N$123
  Bottom 0.508: R60.2 C26.2
N$124
  Bottom 0.508: C22.2 R40.2
N$125
  Top 0.305: 86.55,20.48 U$16.0
  Top 0.508: 86.55,20.48 86.55,21.09 J41.2
N$126
  Top 0.305: 88.45,20.8 U$16.1
  Top 0.508: J41.1 88.45,20.8
N$127  (2 unrouted)
  Bottom 0.508: J16.24 J15.24
N$128  (2 unrouted)
  Bottom 0.508: J16.30 J15.30
N$129  (2 unrouted)
  Bottom 0.508: J15.29 J16.29 | J16.29 123.62,67.78 123.6,67.8 123.6,67.27 J16.29
N$130
  Bottom 0.508: IC3.3 140.23,74.57 139.6,75.2 133.1,75.2 132.4,75.9 132.4,76.5 U$4.1
N$131  (via drill 0.35)
  Top 0.508: U$4.2 135.04,71.94 v134.8,71.7
  Bottom 0.508: v134.8,71.7 135.5,71 137.3,71 139,72.7 139,73.53 IC3.2
N$132  (via drill 0.35)
  Top 0.508: U$4.3 137.6,76.58 v137.6,69.9
  Bottom 0.508: IC3.5 142.77,72.47 142.3,72 139.6,72 137.6,70 v137.6,69.9
N$133  (via drill 0.35)
  Top 0.508: U$4.4 140.12,71.04 v140.2,70.96
  Bottom 0.508: v140.2,70.96 143.26,70.96 144.04,71.74 IC3.6
N$134  (via drill 0.35)
  Top 0.508: U$4.5 142.66,65.84 v142.7,65.8
  Bottom 0.508: IC3.10 142.77,65.87 v142.7,65.8
N$135  (via drill 0.35)
  Top 0.508: v144.1,65.8 144.1,75.5 U$4.6
  Bottom 0.508: v144.1,65.8 144.04,65.86 IC3.9
N$136  (via drill 0.35)
  Top 0.508: v139.7,65.5 139.6,65.5 139.1,66 v139.1,70.2
  Bottom 0.508: U$4.7 147.74,72.34 145.53,70.13 139.17,70.13 v139.1,70.2 | IC3.12 140.23,66.03 v139.7,65.5
N$137
  Bottom 0.508: IC3.13 138.96,68.66 139.6,69.3 148,69.3 150.28,71.58 U$4.8
N$138
  Bottom 0.508: U$5.1 153.6,75.8 154.2,75.2 160.2,75.2 160.73,74.67 IC4.3
N$139  (2 unrouted)
  Bottom 0.508: J16.28 J15.28
N$140  (2 unrouted)
  Bottom 0.508: J15.27 J16.27
N$141  (2 unrouted)
  Bottom 0.508: J16.26 J15.26
N$142  (2 unrouted)
  Bottom 0.508: J15.25 J16.25
N$143  (2 unrouted)
  Bottom 0.508: J16.23 J15.23
N$144  (2 unrouted)
  Bottom 0.508: J15.22 J16.22
N$145  (2 unrouted)
  Bottom 0.508: J16.21 J15.21
N$146
  Bottom 0.508: J26.1 143.4,22.2 144.3,23.1 144.3,25.62 IC6.2
N$147  (2 unrouted)
  Bottom 0.508: J15.20 J16.20
N$148  (2 unrouted)
  Bottom 0.508: J16.19 J15.19
N$149  (2 unrouted)
  Bottom 0.508: J15.18 J16.18
N$150  (2 unrouted)
  Bottom 0.508: J16.17 J15.17
N$151  (2 unrouted)
  Bottom 0.508: J15.16 J16.16
N$152  (2 unrouted)
  Bottom 0.508: J16.15 J15.15
N$153  (2 unrouted)
  Bottom 0.508: J15.14 J16.14
N$154  (2 unrouted)
  Bottom 0.508: J16.13 J15.13
N$155  (via drill 0.35)
  Top 0.508: v145,22.2 137.2,22.2 134.66,24.74 J26.2
  Bottom 0.508: IC6.1 145.5,22.7 v145,22.2
N$156
  Bottom 0.508: J26.3 135.22,28.4 142.4,28.4 142.97,27.84 IC6.3
N$157
  Bottom 0.508: IC6.12 140.43,34.27 140,34.7 136.5,34.7 135,33.2 J27.1
N$158
  Bottom 0.508: J27.2 140.86,35.74 141.69,34.91 IC6.13
N$159  (via drill 0.35)
  Top 0.508: J27.3 137.92,38.28 139.2,37 v139.2,33.7
  Bottom 0.508: v139.2,33.7 139.2,31.88 IC6.11
N$160
  Bottom 0.508: J28.1 165.2,22.2 166.2,23.2 166.2,25.62 IC7.2
N$161  (via drill 0.35)
  Top 0.508: J28.2 159.04,21.9 v167.2,21.9
  Bottom 0.508: v167.2,21.9 167.41,22.11 IC7.1
N$162
  Bottom 0.508: J28.3 157.42,28.5 164.2,28.5 164.87,27.84 IC7.3
N$163  (2 unrouted)
  Bottom 0.508: J15.12 J16.12
N$164  (2 unrouted)
  Bottom 0.508: J16.11 J15.11
N$165  (2 unrouted)
  Bottom 0.508: J15.10 J16.10
N$166  (2 unrouted)
  Bottom 0.508: J16.9 J15.9
N$167  (2 unrouted)
  Bottom 0.508: J15.8 J16.8
N$168  (2 unrouted)
  Bottom 0.508: J16.7 J15.7
N$169  (2 unrouted)
  Bottom 0.508: J15.6 J16.6
N$170  (2 unrouted)
  Bottom 0.508: J16.5 J15.5
N$171
  Bottom 0.508: J29.1 156.8,33.2 158.3,34.7 161.8,34.7 162.32,34.17 IC7.12
N$172
  Bottom 0.508: J29.2 162.56,35.74 163.59,34.7 IC7.13
N$173  (via drill 0.35)
  Top 0.508: v161.1,33.7 161.1,37.1 159.92,38.28 J29.3
  Bottom 0.508: IC7.11 161.1,31.88 v161.1,33.7
N$174  (2 unrouted)
  Bottom 0.508: J15.4 J16.4
N$175  (2 unrouted)
  Bottom 0.508: J16.3 J15.3
N$176  (2 unrouted)
  Bottom 0.508: J15.2 J16.2
N$177  (2 unrouted)
  Bottom 0.508: J16.1 J15.1
N$178  (via drill 0.35)
  Top 0.508: v139.5,23.6 139.64,23.46 J47.2
  Bottom 0.508: IC6.6 139.16,23.95 v139.5,23.6
N$179  (via drill 0.35)
  Top 0.508: J48.2 142.2,34.46 137.8,30.06 v137.8,23.8
  Bottom 0.508: IC6.7 137.88,23.89 v137.8,23.8
N$180  (via drill 0.35)
  Top 0.508: v161.2,23.7 161.44,23.46 J49.2
  Bottom 0.508: IC7.6 161.06,23.84 v161.2,23.7
N$181  (via drill 0.35)
  Top 0.508: v159.8,23.8 159.8,30.5 163.76,34.46 J50.2
  Bottom 0.508: IC7.7 159.8,25.67 v159.8,23.8
N$182
  Bottom 0.508: LED5.1 80.39,75.77 R49.2
N$183
  Bottom 0.508: D7.A 132.62,86.7 J53.3
N$184
  Bottom 0.508: D6.A 132.66,89.2 J53.2
N$185
  Bottom 0.508: LED6.1 82.89,76.42 82.3,75.84 R50.2
N$186  (via drill 0.35)
  Top 0.508: v156.3,71.6 156.14,71.76 U$5.2
  Bottom 0.508: IC4.2 159.46,71.86 158.9,71.3 156.6,71.3 v156.3,71.6
N$187  (via drill 0.35)
  Top 0.508: v158.6,69.8 158.6,76.62 U$5.3
  Bottom 0.508: IC4.5 163.27,72.07 163.2,72 160.8,72 v158.6,69.8
N$188  (via drill 0.35)
  Top 0.508: v161.4,71.16 161.22,71.34 U$5.4
  Bottom 0.508: IC4.6 164.54,71.54 164.16,71.16 v161.4,71.16
N$189  (via drill 0.35)
  Top 0.508: U$5.5 163.76,65.76 v163.3,65.3
  Bottom 0.508: v163.3,65.3 163.27,65.33 IC4.10
N$190  (via drill 0.35)
  Top 0.508: U$5.6 164.9,75.3 v164.9,65.3
  Bottom 0.508: v164.9,65.3 164.54,65.66 IC4.9
N$191  (via drill 0.35)
  Top 0.508: U$5.7 169,76.54 v169,69.3
  Bottom 0.508: v169,69.3 168.9,69.2 161.3,69.2 160.73,68.63 IC4.12
N$192  (via drill 0.35)
  Top 0.508: v171.1,70.5 171.38,70.78 U$5.8
  Bottom 0.508: IC4.13 159.46,68.76 160.9,70.2 170.8,70.2 v171.1,70.5
N$193  (via drill 0.35)
  Top 0.508: v135.96,73.5 135.96,66.94 138.1,64.8 v138.5,64.8
  Bottom 0.508: IC3.1 137.62,73.5 v135.96,73.5 | U$6.1 142.6,63.8 139.5,63.8 v138.5,64.8
N$194  (via drill 0.35)
  Top 0.508: U$6.2 145.54,71.46 145.4,71.6 v145.4,71.8
  Bottom 0.508: v145.4,71.8 145.31,71.89 IC3.7
N$195
  Bottom 0.508: IC3.8 146.77,67.43 148.08,66.12 U$6.3
N$196
  Bottom 0.508: U$6.4 149.12,62.7 139.2,62.7 137.6,64.3 137.6,67.34 IC3.14
N$197  (via drill 0.35)
  Top 0.508: v153.4,73.4 153.16,73.16 U$6.5
  Bottom 0.508: IC4.1 158.02,73.4 v153.4,73.4
N$198  (via drill 0.35)
  Top 0.508: v167,64 167,73.6 v167.1,73.7
  Bottom 0.508: v167,64 164.4,61.4 157.2,61.4 155.6,63 155.6,64.1 U$6.6 | v167.1,73.7 166.97,73.57 IC4.7
N$199
  Bottom 0.508: D5.C J44.1
N$200
  Bottom 0.508: IC4.8 165.81,64.21 164,62.4 159,62.4 158.2,63.2 158.2,64.16 U$6.7
N$201
  Bottom 0.508: IC4.14 158.19,66.41 160.4,64.2 U$6.8
N$202
  Bottom 0.508: D6.C 141.54,89.2 J44.2
N$203
  Bottom 0.508: D7.C 141.58,86.7 J44.3
N$204
  Bottom 0.508: LED7.1 85.39,75.33 R51.2
N$205
  Bottom 0.508: T1.2 146.5,82.95 J31.1
N$206  (via drill 0.35)
  Top 0.508: v151.8,81.4 149.04,84.16 J31.2
  Bottom 0.508: T1.1 v151.8,81.4
N$207
  Bottom 0.508: T1.3 151.1,83.6 151.58,84.08 J31.3
N$208
  Bottom 0.508: T2.2 156.5,82.95 J32.1
N$209  (via drill 0.35)
  Top 0.508: J32.2 159.04,84.16 v161.8,81.4
  Bottom 0.508: v161.8,81.4 T2.1
N$210
  Bottom 0.508: T2.3 161.1,83.6 161.6,84.1 161.6,85.98 J32.3
N$211
  Bottom 0.508: T3.2 166.5,82.95 J33.1
N$212  (via drill 0.35)
  Top 0.508: J33.2 169.04,84.16 v171.8,81.4
  Bottom 0.508: v171.8,81.4 T3.1
N$213
  Bottom 0.508: T3.3 170.9,83.6 171.58,84.28 J33.3
N$214
  Bottom 0.508: LED8.1 87.98,75.25 R52.2
N$215
  Bottom 0.508: LED9.1 90.48,76.61 91,76.1 R53.2
N$216
  Bottom 0.508: LED7.4 84.22,76.42 83.8,76 R35.2
N$217
  Bottom 0.508: T4.3 147.5,92.6 146.5,93.6 J34.1
N$218
  Bottom 0.508: J34.2 150.7,93.34 150.7,91.15 T4.1
N$219
  Bottom 0.508: T4.2 148.05,89.35 148.6,88.8 151.2,88.8 151.7,89.3 151.7,94.88 J34.3
N$220
  Bottom 0.508: T5.3 157.5,92.6 156.5,93.6 J35.1
N$221
  Bottom 0.508: T5.1 160.5,90.95 160.5,93.54 J35.2
N$222
  Bottom 0.508: J35.3 161.58,89.58 160.8,88.8 158.5,88.8 158,89.3 158,90.35 T5.2
N$223
  Bottom 0.508: J30.1 157.7,10 159.17,11.47 IC8.2
N$224  (via drill 0.35)
  Top 0.508: v158.6,13.8 162.1,13.8 163.24,12.66 169.45,12.66 170.46,13.67 170.47,13.67 J51.1
  Bottom 0.508: IC8.3 159.66,12.74 v158.6,13.8 | R39.2 170.56,15.44 J51.1
N$225
  Bottom 0.508: C21.1 165.93,14.23 IC8.5
N$226  (via drill 0.35)
  Top 0.508: v164.2,11.5 164.42,11.5 164.46,11.54 157.4,11.54 J30.2
  Bottom 0.508: IC8.7 164.23,11.47 v164.2,11.5
N$227  (via drill 0.35)
  Top 0.508: J30.3 162.62,15.08 v164.2,13.5
  Bottom 0.508: v164.2,13.5 164.96,12.74 IC8.6
N$231
  Top 0.508: J21.1 56.99,39 53.64,35.66 | 53.64,35.66 S2.3 | 53.64,35.66 53.64,22.3 | 53.64,22.3 53.64,12.66 S8.3 | S5.3 51.79,22.3 53.64,22.3
N$232
  Top 0.508: J21.2 64.04,36.05 | 64.04,36.05 S3.3 | 64.04,36.05 64.04,22.2 | 64.04,22.2 64.04,13.05 S9.3 | S6.3 63.99,22.25 64.04,22.2
N$234
  Bottom 0.508: J39.1 73.54,48.3 PH1.1
N$235
  Bottom 0.508: PH1.3 73.48,45.76 J39.2
N$236
  Bottom 0.508: J40.1 107.47,48.27 101.42,48.27 NTC.2
N$237
  Bottom 0.813: P2.3 110.1,14.1 110.1,17.9 109.2,18.8 109.2,23.5 110.04,24.34 110.04,38.96 J23.1
N$238
  Bottom 0.813: J23.2 107.46,14.04 P2.2
N$239
  Bottom 0.813: P2.1 105,17.8 105.9,18.7 105.9,23.4 104.92,24.38 J23.3
N$240
  Top 0.813: J22.1 121.96,27.54 122,27.54 122,17.2 127.4,17.2 129.2,15.4 129.2,6.1 128.3,5.2 127.65,5.2 P1.3
N$241
  Top 0.813: P1.2 111.75,9.15 114.76,12.16 J22.2
N$242
  Top 0.813: J22.3 112.16,32.2 107.5,27.54 107.5,17.5 102.2,17.5 100.4,15.7 100.4,5.7 101.2,4.9 101.95,4.9 P1.1
N$243
  Bottom 0.813: P3.3 124.5,18.3 123.6,19.2 123.6,23.1 124.54,24.04 124.5,24.08 J24.1
N$244
  Bottom 0.813: P3.2 122,27.2 122,38.96 J24.2
N$245
  Bottom 0.813: P3.1 119.4,14.1 119.4,18.1 120.4,19.1 120.4,23.3 119.42,24.28 J24.3
N$246
  Bottom 0.508: LED8.4 86.81,75.25 R36.2
N$247
  Bottom 0.508: LED9.4 89.31,76.39 89.6,76.1 R37.2
N$248
  Bottom 0.508: LED10.4 91.81,76.58 92.46,75.94 R54.2
N$249
  Bottom 0.508: MIC.2 59.15,45.8 J38.1
N$250
  Bottom 0.508: J38.2 59.01,48.34 MIC.1
N$251
  Bottom 0.508: LED11.4 94.52,75.62 R55.2
N$252
  Bottom 0.508: LED12.4 97.02,75.67 R56.2
N$253
  Bottom 0.508: J20.3 44.38,9.48 45.3,10.4 45.3,26.2 49.6,30.5 56.4,30.5 | 56.4,30.5 65.9,30.5 | 65.9,30.5 75.5,30.5 76.26,31.26 S4.1 | 65.9,30.5 66.26,30.86 S3.1 | 56.4,30.5 56.4,33.61 S2.1
N$256
  Bottom 0.508: NTC.1 101.39,45.76 J40.2
N$257
  Bottom 0.508: SP1.+ 68.76,87.65 J54.2
N$258
  Bottom 0.508: J20.2 45.74,6.94 47.5,8.7 47.5,17 49.7,19.2 56.5,19.2 | 56.5,19.2 66.5,19.2 | 66.5,19.2 75.3,19.2 76.26,20.16 S7.1 | S6.1 66.26,19.44 66.5,19.2 | 56.5,19.2 56.26,19.44 S5.1
N$260
  Top 0.508: S10.3 69.4,13.09 69.4,22.3 | J21.3 69.4,39 | 69.4,39 69.6,39 71.74,36.86 S4.3 | 69.4,22.3 69.4,39 | S7.3 69.45,22.25 69.4,22.3
N$261
  Bottom 0.508: J20.1 46.7,4.4 49.7,7.4 56.3,7.4 | 56.3,7.4 66.4,7.4 | 66.4,7.4 75.9,7.4 76.4,7.9 76.4,10.61 S10.1 | S9.1 66.26,7.54 66.4,7.4 | S8.1 56.26,7.44 56.3,7.4
N$264
  Top 0.508: JACK.3 52.42,89.92 PH12.3
N$291
  Bottom 0.508: SP1.- 75.1,91.44 71.3,87.64 J54.1
N$308
  Bottom 0.508: RGB.R 84.9,92.7 R57.1
N$310
  Bottom 0.508: RGB.B 90,91.81 R59.1
O1A  (via drill 0.35)
  Top 0.508: U$3.1 154.5,59.9 v156.4,58
  Bottom 0.508: IC15.1 156.4,54.64 v156.4,58 154.32,58 ARR3.1
O1B  (via drill 0.35)
  Top 0.508: U$3.2 152.04,57.36 v153.95,55.45
  Bottom 0.508: IC15.2 155.07,53.04 154.51,53.6 154.51,54.89 v153.95,55.45 153.4,56 ARR3.2
O1Y
  Bottom 0.508: IC15.3 157.07,51.77 157.6,52.3 157.6,53.9 158.5,54.8 J43.1
O2A  (via drill 0.35)
  Top 0.508: U$3.3 153.26,54.82 v153.68,54.41
  Bottom 0.508: IC15.4 154.5,50.5 153.8,51.2 153.8,54.3 152.6,55.5 | 152.6,55.5 ARR3.3 | v153.68,54.41 152.6,55.48 152.6,55.5
O2B  (via drill 0.35)
  Top 0.508: U$3.4 152.82,52.28 v152.9,52.2
  Bottom 0.508: ARR3.4 151.8,55.1 152.9,54 v152.9,52.2 152.9,50.5 154.17,49.23 IC15.5
O2Y
  Bottom 0.508: IC15.6 157.06,47.96 157.7,48.6 157.7,50.76 J43.2
O3A  (via drill 0.35)
  Top 0.508: v154.9,42.3 152,45.2 v152,47.6 152.8,47.6 153.2,48 153.2,49.3 152.76,49.74 U$3.5
  Bottom 0.508: IC15.9 151.64,47.96 v152,47.6 | v154.9,42.3 154.2,43 ARR4.1
O3B  (via drill 0.35)
  Top 0.508: v152,48.8 150.4,47.2 | 150.4,47.2 U$3.6 | v153.4,42.2 150.4,45.2 150.4,47.2
  Bottom 0.508: IC15.10 151.57,49.23 v152,48.8 | ARR4.2 v153.4,42.2
O3Y  (via drill 0.35)
  Top 0.508: v153.5,46.8 156.42,49.72 J43.3
  Bottom 0.508: IC15.8 153.39,46.69 v153.5,46.8
O4A  (via drill 0.35)
  Top 0.508: U$3.7 148.16,44.66 v148.9,45.4
  Bottom 0.508: U$3.7 148.56,42.4 152.3,42.4 152.6,42.7 ARR4.3 | v148.9,45.4 148.45,45.85 148.45,51.25 149,51.8 149.9,51.8 IC15.12
O4B  (via drill 0.35)
  Top 0.508: U$3.8 147.63,43.45 v149.65,43.45
  Bottom 0.508: IC15.13 148.84,53.04 147.7,51.9 147.7,45.4 v149.65,43.45 149.72,43.38 ARR4.4
O4Y  (via drill 0.35)
  Top 0.508: J43.4 156.68,47.18 v155,45.5
  Bottom 0.508: v155,45.5 154.34,46.16 154.34,47.86 151.7,50.5 IC15.11
OUT_L+
  Bottom 0.508: J3.1 150.16,16.45 IC11.1
OUT_L-
  Bottom 0.508: IC11.3 150.16,13.9 J3.2
OUT_R+  (via drill 0.35)
  Top 0.508: J3.3 144.08,10.72 v138.4,16.4
  Bottom 0.508: v138.4,16.4 140.28,16.4 IC11.16
OUT_R-  (via drill 0.35)
  Top 0.508: v138.6,13.9 144.32,8.18 J3.4
  Bottom 0.508: IC11.14 v138.6,13.9
R
  Bottom 0.508: R57.2 J37.1
SA
  Bottom 0.508: R41.2 123.3,96.08 U$1.7
SA'  (via drill 0.35)
  Top 0.508: v110.5,86.3 121.4,86.3 v121.7,86
  Bottom 0.508: R41.1 121.7,89.54 v121.7,86 | U$7.13 108.14,86.3 v110.5,86.3
SB
  Bottom 0.508: R42.2 125.9,96.1 U$1.6
SB'  (via drill 0.35)
  Top 0.508: v110.4,87.7 125.7,87.7 v125.8,87.8
  Bottom 0.508: U$7.12 108.14,87.7 v110.4,87.7 | v125.8,87.8 125.8,91.04 R42.1
SC
  Bottom 0.508: R43.2 123.3,80.92 U$1.4
SC'  (via drill 0.35)
  Top 0.508: v110.3,88.9 v123.2,88.9
  Bottom 0.508: U$7.11 v110.3,88.91 v110.3,88.9 | v123.2,88.9 123.3,88.9 R43.1
SD
  Bottom 0.508: R44.2 118.3,80.92 U$1.2
SD'  (via drill 0.35)
  Top 0.508: v110,90.2 119.1,90.2 v119.3,90
  Bottom 0.508: U$7.10 109.97,90.17 v110,90.2 | v119.3,90 119.3,86.86 R44.1
SE
  Bottom 0.508: U$1.1 115.72,84.14 R45.2
SE'
  Bottom 0.508: U$7.9 113.56,91.44 114.8,90.2 114.8,86.3 115.24,85.86 R45.1
SF
  Bottom 0.508: R46.2 118.3,96.08 U$1.9
SF'  (via drill 0.35)
  Top 0.508: v120.7,83.9 120.6,83.8 v110.5,83.8
  Bottom 0.508: R46.1 120.06,91.14 120.7,90.5 v120.7,83.9 | v110.5,83.8 108.1,83.8 U$7.15
SG
  Bottom 0.508: R47.2 115.7,96.1 U$1.10
SG'  (via drill 0.35)
  Top 0.508: v110.5,85.1 116.9,85.1 v117,85
  Bottom 0.508: U$7.14 v110.5,85.09 v110.5,85.1 | v117,85 117,87.4 115.7,88.7 R47.1
V_USB  (via drill 0.35)
  Top 0.508: v41.6,93.45 39.22,95.83 34.41,95.83 32.14,98.1 S1.3
  Bottom 0.508: C37.1 18.15,83.77 IC9.4 16.61,83.89 15.9,84.6 15.9,87.6 15.79,87.7 14.75,87.7 | IC9.8 14.75,87.7 | LED1.2 LED1.3 41.37,93.69 v41.6,93.45 | 14.75,87.7 14.7,87.75 X8.VBUS 16.88,95.6 25,95.6 26.21,96.81 29.21,96.81 S1.3
VBAT  (via drill 0.35)
  Top 0.508: v13.35,82.8 13.35,87.45 14.5,88.6 21.35,88.6 22.8,90.05 22.8,95.6 25.3,98.1 S1.6
  Bottom 0.508: IC9.5 13.35,83.67 v13.35,82.8 C28.1 13.35,72.55 12.8,72 J1.1
VCC  (via drill 0.35)  (28 unrouted)
  Top 0.508: v141.5,75.3 141.5,69.1 140.7,68.3 140.7,61.9 v140.6,61.8 | v162.1,75.2 162.4,74.9 162.4,62.4 161.7,61.7 160.7,61.7 | 160.7,61.7 v155.4,61.7 | v163.9,58.5 160.7,61.7 | J19.1 47.3,71 45.15,73.15 v45.15,86.8 | v163.6,27.4 163.6,29.4 v163.7,29.5 | v141.7,27.4 141.7,29.4 v141.8,29.5
  Bottom 0.305: 116.47,49.7 U1.14 U1.15
  Bottom 0.508: R31.1 45.15,94.58 v45.15,86.8 45.15,86.45 41.7,83 | 52.4,70.9 J19.1 108.2,71 | 108.2,71 J19.30 | F1.1 41.7,83 | 41.7,83 41.8,82.9 | 126.97,70.19 J19.30 | IC3.4 v141.5,75.3 | J19.30 129,68.16 129,62.2 129.4,61.8 | 134.4,61.8 v140.6,61.8 149.9,61.8 | 134.4,61.8 129.4,61.8 | IC4.4 162,75.1 v162.1,75.2 | v155.4,61.7 155.3,61.8 149.9,61.8 | IC13.14 134.3,54.94 134.3,61.7 134.4,61.8 | IC15.14 149.93,61.77 149.9,61.8 | IC14.14 164.43,57.77 164,58.2 164,58.4 v163.9,58.5 | 129.4,29.5 129.4,51.3 | 129.4,51.3 129.4,61.8 | C24.1 148.08,10.78 147.4,10.1 IC11.6 143.91,10.1 143.5,10.5 | 143.5,10.5 143.5,12.7 | 143.5,12.7 143.5,18.4 143.2,18.7 | 143.2,18.7 130.5,18.7 129.4,19.8 129.4,29.5 | 143.2,18.7 159.9,18.7 161,17.6 161,14.28 IC8.4 162.29,14.01 163.3,13 163.3,10.7 163.8,10.2 IC8.8 | IC11.4 143.56,12.63 | 143.56,12.63 143.5,12.7 | 143.56,12.63 IC11.13 138.28,12.63 C23.1 | C27.+ 143.5,6.9 143.5,10.5 | 121.1,49.7 122.7,51.3 129.4,51.3 | C32.1 121.1,49.7 | 121.1,49.7 116.47,49.7 | 108.2,71 108.07,71.13 U$7.16 106.55,82.56 106.1,83 106.1,84.3 105.31,85.09 U$7.3 U$7.4 | 129.4,29.5 137.7,29.5 | 137.7,29.5 v141.8,29.5 142.9,29.5 | 142.9,29.5 144.2,29.5 | 144.2,29.5 145.5,29.5 | 145.5,29.5 159.8,29.5 | 159.8,29.5 v163.7,29.5 165,29.5 | 165,29.5 166,29.5 | 166,29.5 167,29.5 167.41,29.91 IC7.16 | IC6.16 145.5,29.5 | IC7.14 164.87,29.64 165,29.5 | IC7.15 166.13,29.64 166,29.5 | IC7.4 v163.59,27.39 v163.6,27.4 | IC7.10 159.8,31.82 159.8,29.5 | IC6.15 144.24,29.54 144.2,29.5 | IC6.14 142.97,29.57 142.9,29.5 | IC6.4 v141.69,27.39 v141.7,27.4 | IC6.10 137.88,29.68 137.7,29.5
VOUT
  Bottom 0.508: U3.2 27.5,82.3 28.3,83.1 31.6,83.1 32.1,82.6 32.95,82.6 C39.1 36.23,82.65 F1.2
VREF
  Bottom 0.508: C25.1 148.41,7.55 IC11.8
X+  (via drill 0.35)
  Top 0.508: v114.14,47.96 115.48,49.3 J25.1
  Bottom 0.305: U1.12 114.16,47.98 v114.14,47.96
  Bottom 0.508: C29.1 J25.1
Y+  (via drill 0.35)
  Top 0.508: J25.2 114.17,46.76 v114.13,46.8
  Bottom 0.305: v114.13,46.8 114.26,46.67 U1.10
  Bottom 0.508: C30.1 126.6,46.76 J25.2
Z+  (via drill 0.35)
  Top 0.508: v114.1,45.3 115.18,44.22 J25.3
  Bottom 0.305: U1.8 115.78,45.3 v114.1,45.3
  Bottom 0.508: C31.1 124.62,44.2 J25.3

## Text on the board
tNames: A | C | 3.5mm | - | + | - | + | - | + | - | + | - | + | - | + | - | + | - | + | + | - | MQ | + | + | + | +
bNames: JLCJLCJLCJLC
tSilk: DP1 | DP2 | DP3 | DP4 | D1 | D2 | T1 | T2 | T3 | T4 | T5 | T6 | D3 | D4 | T7 | T8 | T9 | T10 | T11 | T12 | T13 | T14 | T15 | L10 | L11 | L12 | D5 | D6 | DP5 | DP6 | D7 | D8 | DP7 | S1 | S2 | S3 | S10 | S11 | DP11 | L1 | L2 | L3 | L4 | L5 | L6 | L7 | L8 | L9 | DP8 | DP12 | DP9 | DP13 | DP10 | AO1 | AO2 | AO3 | AO4 | AO5 | AO6 | AO7 | AO8 | AO9 | AO10 | AO11 | AO12 | AO13 | AO14 | AO15 | AO16 | S4 | S5 | S6 | S7 | S8 | S9 | +1 | +30 | AO17 | AO18 | AO19 | AO20 | AO21 | AO22 | AO23 | AO24 | R1 | R2 | R3 | R4 | R5 | R6 | X1 | X30 | R7 | R8 | R9 | R10 | R11 | R12 | Y1 | Y30 | A1 | O1 | R13 | R14 | R15 | R16 | R17 | R18 | Z1 | Z30 | A2 | O2 | N1 | N7 | R19 | R20 | R21 | R22 | R23 | R24 | -1 | -30 | A3 | A9 | O3 | O9 | N2 | N8 | R25 | R26 | R27 | R28 | R29 | R30 | A4 | A10 | O4 | O10 | N3 | N9 | R31 | R32 | R33 | R34 | R35 | R36 | A5 | A11 | O5 | O11 | N4 | N10 | R37 | R38 | R39 | R40 | R41 | R42 | M1 | LDR1 | NTC1 | A6 | A12 | O6 | O12 | N5 | N11 | R43 | R44 | R45 | R46 | R47 | R48 | M2 | LDR2 | NTC2 | A7 | O7 | N6 | N12 | R49 | R50 | R51 | R52 | R53 | R54 | PB4 | PB5 | PB6 | ST1 | ST2 | ST3 | A8 | O8 | R55 | R56 | R57 | R58 | R59 | R60 | C1 | C2 | C3 | C4 | FF1 | FF6 | FF4 | FF9 | P1 | P2 | P3 | P7 | P8 | P9 | FF2 | FF7 | C5 | C6 | C7 | C8 | P4 | P5 | P6 | FF5 | FF10 | C9 | C10 | C11 | C12 | FF3 | FF8 | C13 | C14 | C15 | C16 | C17 | C18 | C19 | C20 | FF11 | FF16 | FF14 | FF19 | C21 | C22 | C23 | C24 | FF12 | FF17 | C25 | C26 | C27 | C28 | FF15 | FF20 | FF13 | FF18 | C29 | C30 | C31 | C32 | C33 | C34 | C35 | C36 | GEN1 | C37 | C38 | C39 | C40 | GEN2 | GEN4 | GEN3 | PB1 | PB2 | PB3